# Altium schematic sheet [07] - INPUT.SchDoc
size A3; DocumentNumber: 7; SheetNumber: 7; SheetTotal: 10
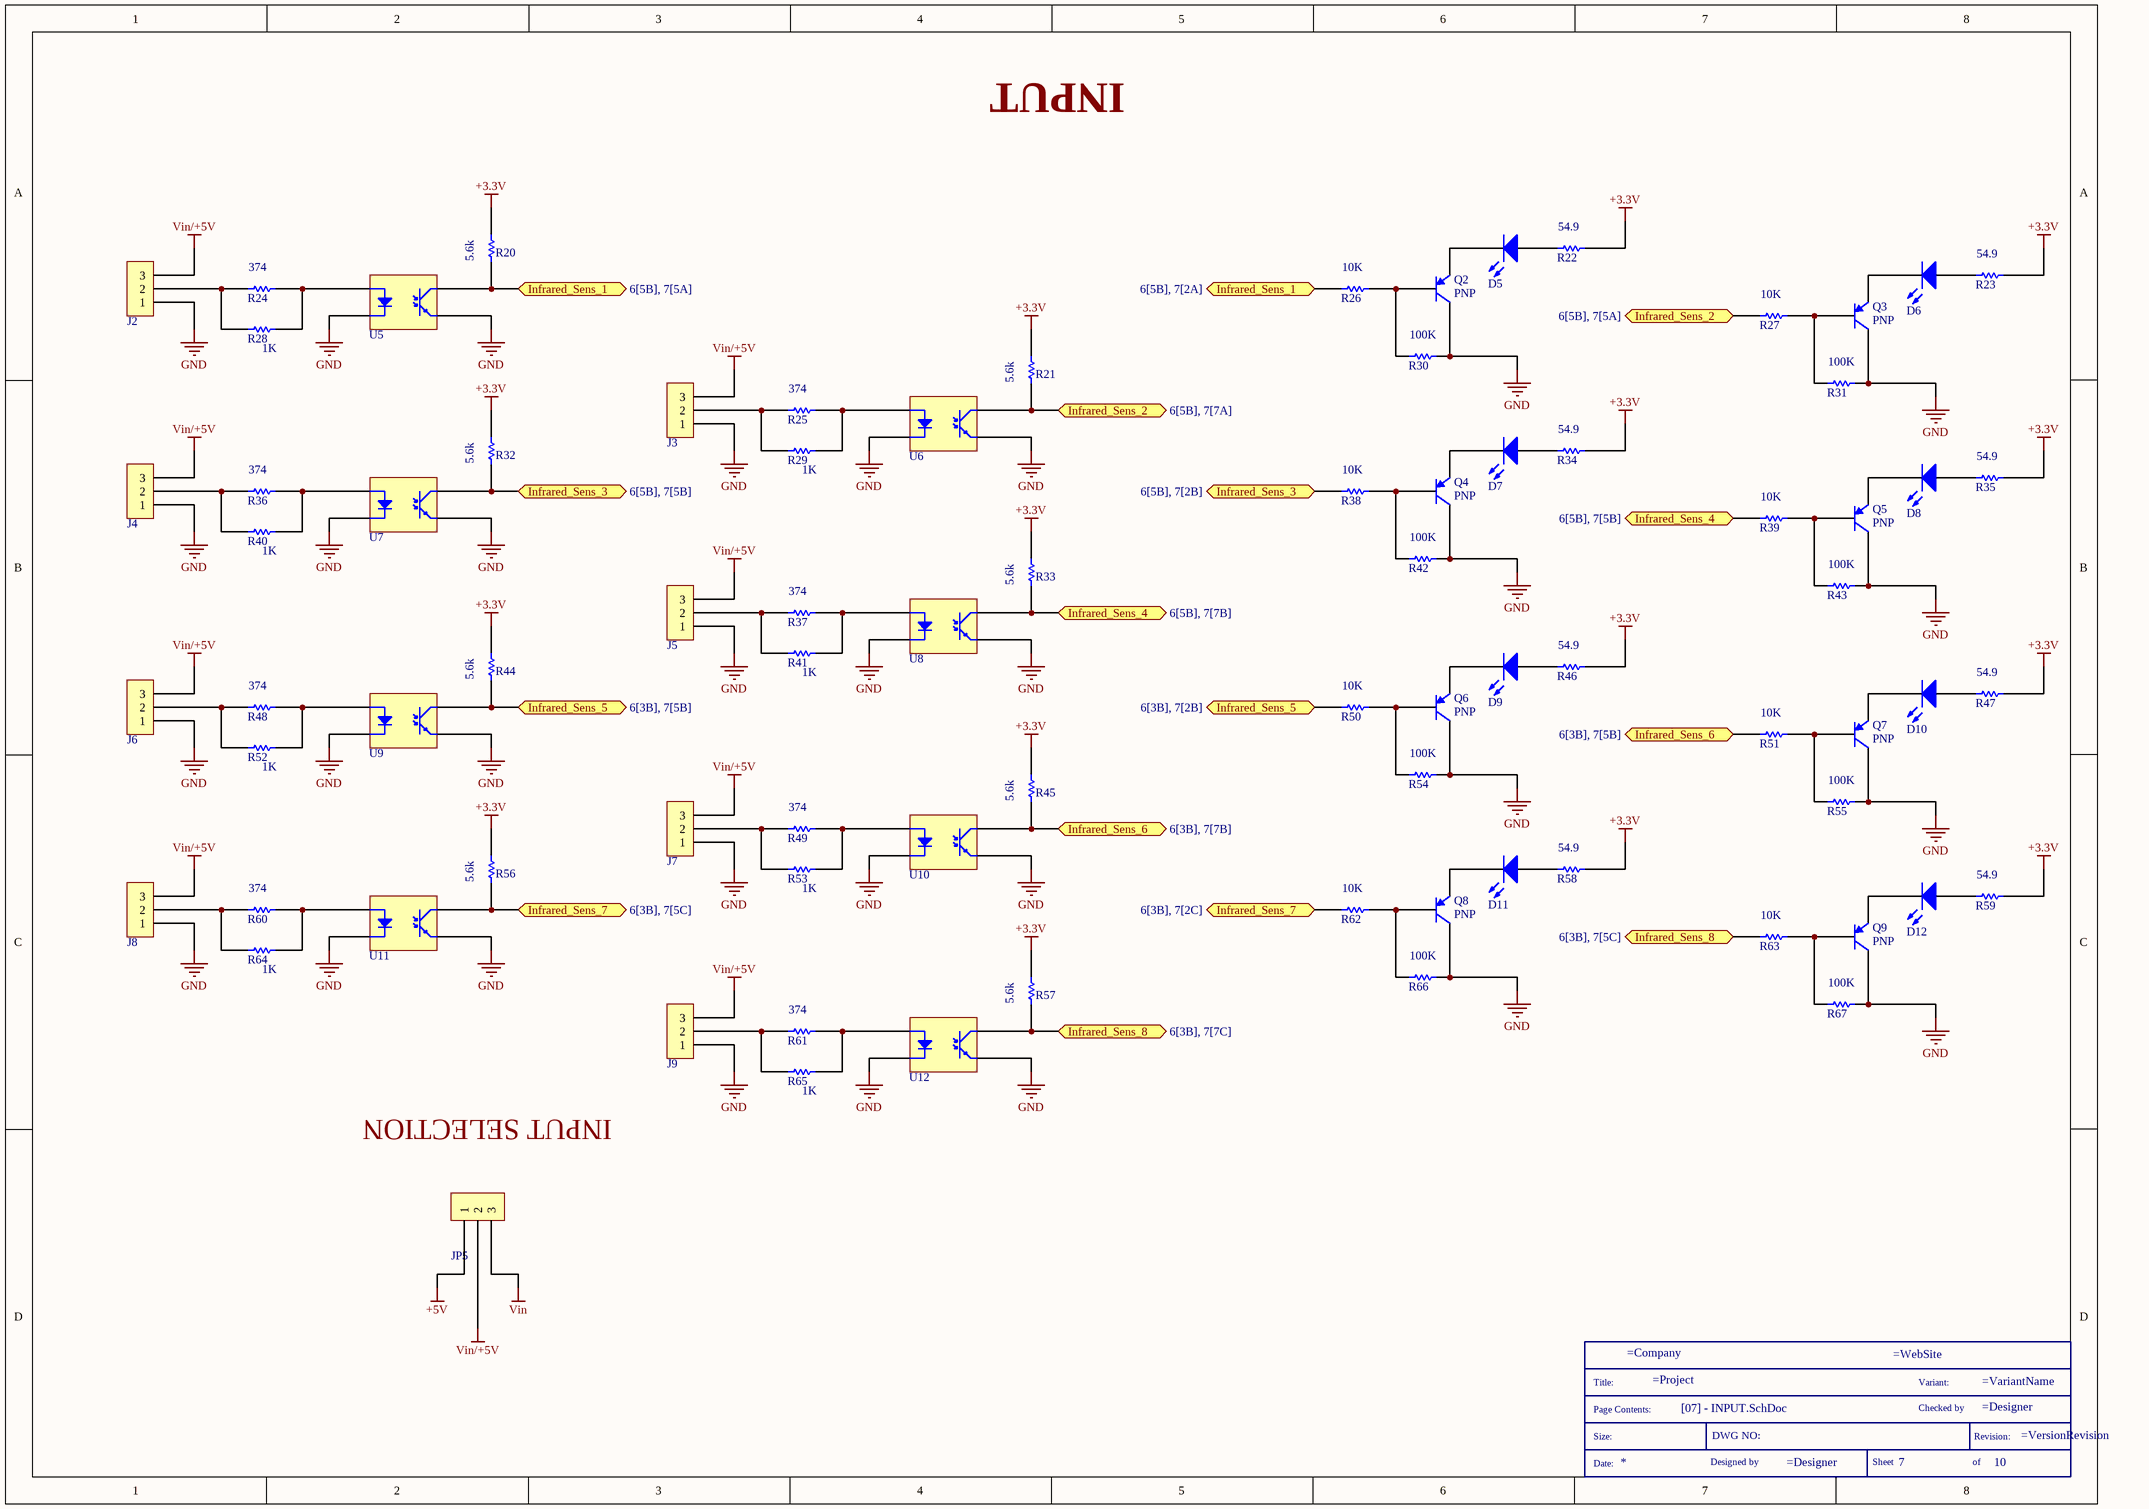
[diagram p0: [07] - INPUT.SchDoc]

## Parts
*  SCH_TITLE  (value not drawn)  (graphical)
D5  Blue Led  [RES_0603]  (value not drawn)
D6  Blue Led  [RES_0603]  (value not drawn)
D7  Blue Led  [RES_0603]  (value not drawn)
D8  Blue Led  [RES_0603]  (value not drawn)
D9  Blue Led  [RES_0603]  (value not drawn)
D10  Blue Led  [RES_0603]  (value not drawn)
D11  Blue Led  [RES_0603]  (value not drawn)
D12  Blue Led  [RES_0603]  (value not drawn)
J2  CONN 1X3 3MM  [CONN_MALE_1X3_3MM]  (value not drawn)
J3  CONN 1X3 3MM  [CONN_MALE_1X3_3MM]  (value not drawn)
J4  CONN 1X3 3MM  [CONN_MALE_1X3_3MM]  (value not drawn)
J5  CONN 1X3 3MM  [CONN_MALE_1X3_3MM]  (value not drawn)
J6  CONN 1X3 3MM  [CONN_MALE_1X3_3MM]  (value not drawn)
J7  CONN 1X3 3MM  [CONN_MALE_1X3_3MM]  (value not drawn)
J8  CONN 1X3 3MM  [CONN_MALE_1X3_3MM]  (value not drawn)
J9  CONN 1X3 3MM  [CONN_MALE_1X3_3MM]  (value not drawn)
JP5  HDR_1X3_2.54  [HDR_MALE_1X3_2.54MM]  (value not drawn)
Q2  PNP  [SOT-23 (TO-236)]
Q3  PNP  [SOT-23 (TO-236)]
Q4  PNP  [SOT-23 (TO-236)]
Q5  PNP  [SOT-23 (TO-236)]
Q6  PNP  [SOT-23 (TO-236)]
Q7  PNP  [SOT-23 (TO-236)]
Q8  PNP  [SOT-23 (TO-236)]
Q9  PNP  [SOT-23 (TO-236)]
R20  5.6k  [RES_0805]
R21  5.6k  [RES_0805]
R22  54.9  [RES_0805]
R23  54.9  [RES_0805]
R24  374  [RES_0805]
R25  374  [RES_0805]
R26  10K  [RES_0805]
R27  10K  [RES_0805]
R28  1K  [RES_0805]
R29  1K  [RES_0805]
R30  100K  [RES_0603]
R31  100K  [RES_0603]
R32  5.6k  [RES_0805]
R33  5.6k  [RES_0805]
R34  54.9  [RES_0805]
R35  54.9  [RES_0805]
R36  374  [RES_0805]
R37  374  [RES_0805]
R38  10K  [RES_0805]
R39  10K  [RES_0805]
R40  1K  [RES_0805]
R41  1K  [RES_0805]
R42  100K  [RES_0603]
R43  100K  [RES_0603]
R44  5.6k  [RES_0805]
R45  5.6k  [RES_0805]
R46  54.9  [RES_0805]
R47  54.9  [RES_0805]
R48  374  [RES_0805]
R49  374  [RES_0805]
R50  10K  [RES_0805]
R51  10K  [RES_0805]
R52  1K  [RES_0805]
R53  1K  [RES_0805]
R54  100K  [RES_0603]
R55  100K  [RES_0603]
R56  5.6k  [RES_0805]
R57  5.6k  [RES_0805]
R58  54.9  [RES_0805]
R59  54.9  [RES_0805]
R60  374  [RES_0805]
R61  374  [RES_0805]
R62  10K  [RES_0805]
R63  10K  [RES_0805]
R64  1K  [RES_0805]
R65  1K  [RES_0805]
R66  100K  [RES_0603]
R67  100K  [RES_0603]
U5  NPN 3.75KV  [SOIC-6]  (value not drawn)
U6  NPN 3.75KV  [SOIC-6]  (value not drawn)
U7  NPN 3.75KV  [SOIC-6]  (value not drawn)
U8  NPN 3.75KV  [SOIC-6]  (value not drawn)
U9  NPN 3.75KV  [SOIC-6]  (value not drawn)
U10  NPN 3.75KV  [SOIC-6]  (value not drawn)
U11  NPN 3.75KV  [SOIC-6]  (value not drawn)
U12  NPN 3.75KV  [SOIC-6]  (value not drawn)

## Ports
Infrared_Sens_1 (see 6[5B], 7[2A]), Infrared_Sens_1 (see 6[5B], 7[5A]), Infrared_Sens_2 (see 6[5B], 7[5A]), Infrared_Sens_2 (see 6[5B], 7[7A]), Infrared_Sens_3 (see 6[5B], 7[2B]), Infrared_Sens_3 (see 6[5B], 7[5B]), Infrared_Sens_4 (see 6[5B], 7[5B]), Infrared_Sens_4 (see 6[5B], 7[7B]), Infrared_Sens_5 (see 6[3B], 7[2B]), Infrared_Sens_5 (see 6[3B], 7[5B]), Infrared_Sens_6 (see 6[3B], 7[5B]), Infrared_Sens_6 (see 6[3B], 7[7B]), Infrared_Sens_7 (see 6[3B], 7[2C]), Infrared_Sens_7 (see 6[3B], 7[5C]), Infrared_Sens_8 (see 6[3B], 7[5C]), Infrared_Sens_8 (see 6[3B], 7[7C])

## Nets
+3.3V: R20.2 R21.2 R22.2 R23.2 R32.2 R33.2 R34.2 R35.2 R44.2 R45.2 R46.2 R47.2 R56.2 R57.2 R58.2 R59.2
+5V: JP5.1
GND: J2.1 J3.1 J4.1 J5.1 J6.1 J7.1 J8.1 J9.1 Q2.1(C) Q3.1(C) Q4.1(C) Q5.1(C) Q6.1(C) Q7.1(C) Q8.1(C) Q9.1(C) R30.2 R31.2 R42.2 R43.2 R54.2 R55.2 R66.2 R67.2 U5.3(K) U5.4(Emit) U6.3(K) U6.4(Emit) U7.3(K) U7.4(Emit) U8.3(K) U8.4(Emit) U9.3(K) U9.4(Emit) U10.3(K) U10.4(Emit) U11.3(K) U11.4(Emit) U12.3(K) U12.4(Emit)
Vin: JP5.3
Vin/+5V: J2.3 J3.3 J4.3 J5.3 J6.3 J7.3 J8.3 J9.3 JP5.2
Infrared_Sens_1: R20.1 R26.1 U5.6(Coll) ; port Infrared_Sens_1
Infrared_Sens_2: R21.1 R27.1 U6.6(Coll) ; port Infrared_Sens_2
Infrared_Sens_3: R32.1 R38.1 U7.6(Coll) ; port Infrared_Sens_3
Infrared_Sens_4: R33.1 R39.1 U8.6(Coll) ; port Infrared_Sens_4
Infrared_Sens_5: R44.1 R50.1 U9.6(Coll) ; port Infrared_Sens_5
Infrared_Sens_6: R45.1 R51.1 U10.6(Coll) ; port Infrared_Sens_6
Infrared_Sens_7: R56.1 R62.1 U11.6(Coll) ; port Infrared_Sens_7
Infrared_Sens_8: R57.1 R63.1 U12.6(Coll) ; port Infrared_Sens_8
NetD5_1: D5.1(A) R22.1
NetD5_2: D5.2(K) Q2.3(E)
NetD6_1: D6.1(A) R23.1
NetD6_2: D6.2(K) Q3.3(E)
NetD7_1: D7.1(A) R34.1
NetD7_2: D7.2(K) Q4.3(E)
NetD8_1: D8.1(A) R35.1
NetD8_2: D8.2(K) Q5.3(E)
NetD9_1: D9.1(A) R46.1
NetD9_2: D9.2(K) Q6.3(E)
NetD10_1: D10.1(A) R47.1
NetD10_2: D10.2(K) Q7.3(E)
NetD11_1: D11.1(A) R58.1
NetD11_2: D11.2(K) Q8.3(E)
NetD12_1: D12.1(A) R59.1
NetD12_2: D12.2(K) Q9.3(E)
NetJ2_2: J2.2 R24.1 R28.1
NetJ3_2: J3.2 R25.1 R29.1
NetJ4_2: J4.2 R36.1 R40.1
NetJ5_2: J5.2 R37.1 R41.1
NetJ6_2: J6.2 R48.1 R52.1
NetJ7_2: J7.2 R49.1 R53.1
NetJ8_2: J8.2 R60.1 R64.1
NetJ9_2: J9.2 R61.1 R65.1
NetQ2_2: Q2.2(B) R26.2 R30.1
NetQ3_2: Q3.2(B) R27.2 R31.1
NetQ4_2: Q4.2(B) R38.2 R42.1
NetQ5_2: Q5.2(B) R39.2 R43.1
NetQ6_2: Q6.2(B) R50.2 R54.1
NetQ7_2: Q7.2(B) R51.2 R55.1
NetQ8_2: Q8.2(B) R62.2 R66.1
NetQ9_2: Q9.2(B) R63.2 R67.1
NetR24_2: R24.2 R28.2 U5.1(A)
NetR25_2: R25.2 R29.2 U6.1(A)
NetR36_2: R36.2 R40.2 U7.1(A)
NetR37_2: R37.2 R41.2 U8.1(A)
NetR48_2: R48.2 R52.2 U9.1(A)
NetR49_2: R49.2 R53.2 U10.1(A)
NetR60_2: R60.2 R64.2 U11.1(A)
NetR61_2: R61.2 R65.2 U12.1(A)

## Notes on the sheet
- INPUT
- INPUT SELECTION
- (in symbol SCH_TITLE) Title:; Variant:; Page Contents:; Checked by; Size:; DWG NO:; Revision:; Date:; Designed by; Sheet; of

## Library data of the parts
* = SCH_TITLE: Schematic information
D5-D12 = EAST16084BA8: LED BLUE CLEAR 2SMD; Manufacturer 1: Everlight Electronics Co Ltd; Category: LED Indication - Discrete; Manufacturer Part Number 1: EAST16084BA8; Case/Package: 0603 (1608 Metric); Quantity: 1; Supplier 1: Digikey; Supplier Part Number 1: 1080-1562-1-ND; Supplier Stock 1: 11914; Supplier Unit Price 1: 0.30; Supplier Currency 1: $
J2-J9 = 66200311122: CONN MALE 1X3 3MM; Manufacturer 1: Wurth Electronics Inc.; Category: Rectangular Connectors - Headers, Male Pins; Manufacturer Part Number 1: 66200311122; Case/Package: 3POS_3mmPitch; Quantity: 1; Supplier 1: Digikey; Supplier Part Number 1: 732-4709-5-ND; Supplier Order Qty 1: 1; Supplier Stock 1: 56; Supplier Unit Price 1: 0,34; Supplier Currency 1: $
JP5 = 61300311121: HDR MALE 1X3 2.54MM; Manufacturer 1: Wurth Electronics Inc.; Category: Rectangular Connectors - Headers, Male Pins; Manufacturer Part Number 1: 61300311121; Case/Package: 3POS pitch 2.54mm; Quantity: 1; Supplier 1: Digikey; Supplier Part Number 1: 732-5316-ND; Supplier Order Qty 1: 1; Supplier Stock 1: 109116; Supplier Unit Price 1: 0,13; Supplier Currency 1: $
Q2-Q9 = MMBT2907A-7-F: TRANS PNP 60V 0.6A SOT23-3; Manufacturer 1: Diodes Incorporated; Category: Transistors - Bipolar (BJT) - Single; Manufacturer Part Number 1: MMBT2907A-7-F; Case/Package: SOT-23-3; Quantity: 1; Supplier 1: Digikey; Supplier Part Number 1: MMBT2907A-FDICT-ND; Supplier Stock 1: 376417; Supplier Unit Price 1: 0.14; Supplier Currency 1: $
R20 R21 R32 R33 R44 R45 R56 R57 = ERJ-6ENF5601V: RES SMD 5.6K OHM 1% 1/8W 0805; Manufacturer 1: Panasonic Electronic Components; Category: Chip Resistor - Surface Mount; Manufacturer Part Number 1: ERJ-6ENF5601V; Case/Package: 0805 (2012 Metric); Quantity: 1; Supplier 1: Digikey; Supplier Part Number 1: P5.60KCCT-ND; Supplier Order Qty 1: 1; Supplier Stock 1: 71341; Supplier Unit Price 1: 0,1; Supplier Currency 1: $
R22 R23 R34 R35 R46 R47 R58 R59 = ERJ-6ENF54R9V: RES SMD 54.9 OHM; Manufacturer 1: Panasonic Electronic Components; Category: Chip Resistor - Surface Mount; Manufacturer Part Number 1: ERJ-6ENF54R9V; Case/Package: 0805 (2012 Metric); Quantity: 1; Supplier 1: Digikey; Supplier Part Number 1: P54.9CCT-ND; Supplier Order Qty 1: 1; Supplier Stock 1: 43715; Supplier Unit Price 1: 0,1; Supplier Currency 1: $
R24 R25 R36 R37 R48 R49 R60 R61 = ERJ-6ENF3740V: RES SMD 374 OHM 1% 1/8W 0805; Manufacturer 1: Panasonic Electronic Components; Category: Chip Resistor - Surface Mount; Manufacturer Part Number 1: ERJ-6ENF3740V; Case/Package: 0805 (2012 Metric); Quantity: 1; Supplier 1: Digikey; Supplier Order Qty 1: 1; Supplier Stock 1: 100272; Supplier Unit Price 1: 0,1; Supplier Currency 1: $; Supplier Part Number 1: P374CCT-ND
R26 R27 R38 R39 R50 R51 R62 R63 = ERJ-6ENF1002V: RES SMD 10K OHM 1% 1/8W 0805; Manufacturer 1: Panasonic Electronic Components; Category: Chip Resistor - Surface Mount; Manufacturer Part Number 1: ERJ-6ENF1002V; Case/Package: 0805 (2012 Metric); Quantity: 1; Supplier 1: Digikey; Supplier Part Number 1: P10.0KCCT-ND; Supplier Order Qty 1: 1; Supplier Stock 1: 2515107; Supplier Unit Price 1: 0,1; Supplier Currency 1: $
R28 R29 R40 R41 R52 R53 R64 R65 = ERJ-6ENF1001V: RES SMD 1K OHM; Manufacturer 1: Panasonic Electronic Components; Category: Chip Resistor - Surface Mount; Manufacturer Part Number 1: ERJ-6ENF1001V; Case/Package: 0805 (2012 Metric); Quantity: 1; Supplier 1: Digikey; Supplier Part Number 1: P1.00KCCT-ND; Supplier Order Qty 1: 1; Supplier Stock 1: 1361018; Supplier Unit Price 1: 0,1; Supplier Currency 1: $
R30 R31 R42 R43 R54 R55 R66 R67 = ERJ-PA3J104V: RES SMD 100K 5% 1/4W 0603; Manufacturer 1: Panasonic Electronic Components; Category: Chip Resistor - Surface Mount; Manufacturer Part Number 1: ERJ-PA3J104V; Case/Package: 0603 (1608 Metric); Quantity: 1; Supplier 1: Digikey; Supplier Part Number 1: P100KBZCT-ND; Supplier Order Qty 1: 1; Supplier Stock 1: 11465; Supplier Unit Price 1: 0,11; Supplier Currency 1: $
U5-U12 = TLP2301(TPL,E: OPTOISO 3.75KV TRANS; Manufacturer 1: Toshiba Semiconductor and Storage; Category: Optoisolators - Transistor, Photovoltaic Output; Manufacturer Part Number 1: TLP2301(TPL,E; Case/Package: 6-SOIC (0.179", 4.55mm Width), 4 Leads; Quantity: 1; Supplier 1: Digikey; Supplier Part Number 1: TLP2301(TPLECT-ND; Supplier Order Qty 1: 1; Supplier Stock 1: 19225; Supplier Unit Price 1: 0,73; Supplier Currency 1: $